# Altium schematic sheet sensor_node1.SchDoc
size Letter
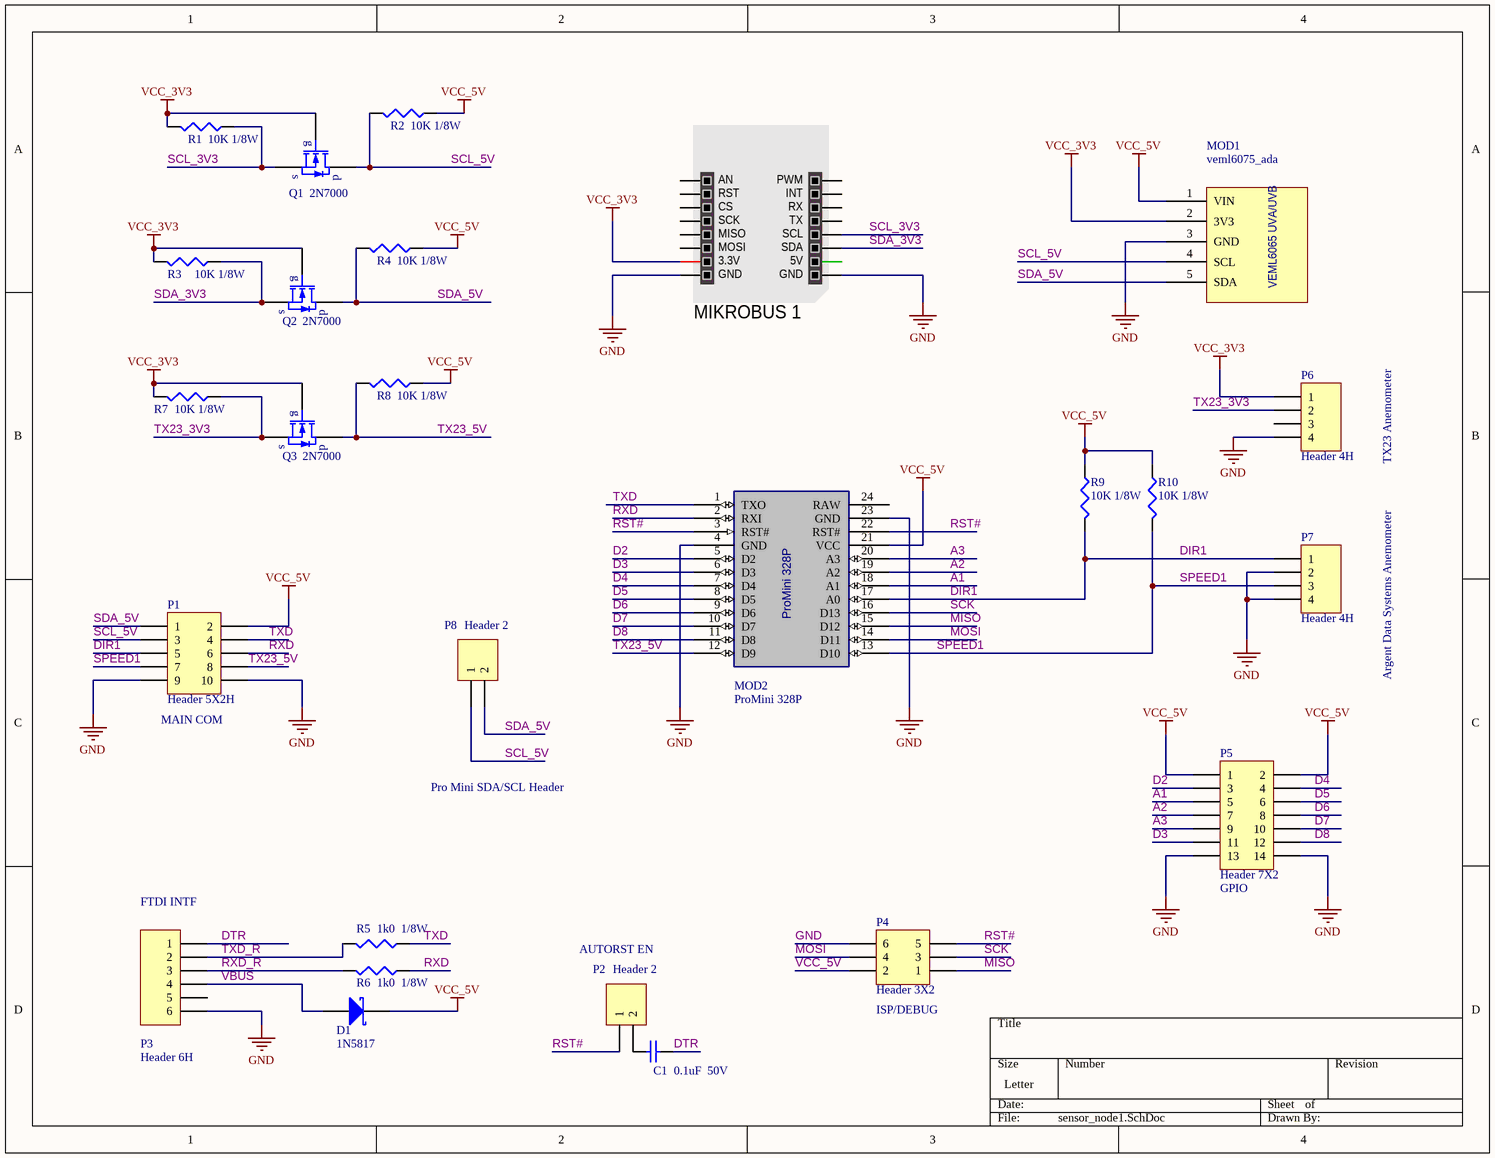
[diagram p0: sensor_node1.SchDoc]

## Parts
C1  value 0.1uF  50V  [CAPR2.54-4x3.2]  (hidden comment: Cap)
D1  1N5817  [DIODE-0.4]
MIKROBUS_1  MIKROBUS HOST CONN.  [MIKROBUS HOST CONN.]  (value not drawn)
MOD1  veml6075_ada  [HDR1X5]
MOD2  ProMini 328P  [promini]
P1  Header 5X2H  [HDR2X5H]
P2  Header 2  [HDR1X2]
P3  Header 6H  [HDR1X6H]
P4  Header 3X2  [HDR2X3]
P5  Header 7X2  [HDR2X7]
P6  Header 4H  [HDR1X4H]
P7  Header 4H  [HDR1X4H]
P8  Header 2  [HDR1X2]
Q1  2N7000  [2N7000-TO92]
Q2  2N7000  [2N7000-TO92]
Q3  2N7000  [2N7000-TO92]
R1  value 10K 1/8W  [RES6.5-3.4X1.9]  (hidden comment: Res3)
R2  value 10K 1/8W  [RES6.5-3.4X1.9]  (hidden comment: Res3)
R3  value 10K 1/8W  [RES6.5-3.4X1.9]  (hidden comment: Res3)
R4  value 10K 1/8W  [RES6.5-3.4X1.9]  (hidden comment: Res3)
R5  value 1k0  1/8W  [RES6.5-3.4X1.9]  (hidden comment: Res3)
R6  value 1k0  1/8W  [RES6.5-3.4X1.9]  (hidden comment: Res3)
R7  value 10K 1/8W  [RES6.5-3.4X1.9]  (hidden comment: Res3)
R8  value 10K 1/8W  [RES6.5-3.4X1.9]  (hidden comment: Res3)
R9  value 10K 1/8W  [RES6.5-3.4X1.9]  (hidden comment: Res3)
R10  value 10K 1/8W  [RES6.5-3.4X1.9]  (hidden comment: Res3)

## Nets
GND: MIKROBUS_1.8(GND) MIKROBUS_1.9(GND) MOD1.3(GND) MOD2.4(GND) MOD2.23(GND) P1.9 P1.10 P3.6 P4.6 P5.13 P5.14 P6.4 P7.2 P7.4
VCC_3V3: MIKROBUS_1.7(3.3V) MOD1.2(3V3) P6.1 Q1.2(G) Q2.2(G) Q3.2(G) R1.2 R3.2 R7.2
VCC_5V: D1.2(K) MOD1.1(VIN) MOD2.21(VCC) P1.2 P4.2 P5.1 P5.2 R2.1 R4.1 R8.1 R9.1 R10.1
A1: MOD2.18(A1) P5.5
A2: MOD2.19(A2) P5.7
A3: MOD2.20(A3) P5.9
D2: MOD2.5(D2) P5.3
D3: MOD2.6(D3) P5.11
D4: MOD2.7(D4) P5.4
D5: MOD2.8(D5) P5.6
D6: MOD2.9(D6) P5.8
D7: MOD2.10(D7) P5.10
D8: MOD2.11(D8) P5.12
DIR1: MOD2.17(A0) P1.5 P7.1 R9.2
DTR: C1.1 P3.1
MISO: MOD2.15(D12) P4.1
MOSI: MOD2.14(D11) P4.4
RST#: MOD2.3(RST#) MOD2.22(RST#) P2.1 P4.5
RXD: MOD2.2(RXI) P1.6 R6.1
RXD_R: P3.3 R6.2
SCK: MOD2.16(D13) P4.3
SCL_3V3: MIKROBUS_1.12(SCL) Q1.1(S) R1.1
SCL_5V: MOD1.4(SCL) P1.3 P8.1 Q1.3(D) R2.2
SDA_3V3: MIKROBUS_1.11(SDA) Q2.1(S) R3.1
SDA_5V: MOD1.5(SDA) P1.1 P8.2 Q2.3(D) R4.2
SPEED1: MOD2.13(D10) P1.7 P7.3 R10.2
TX23_3V3: P6.2 Q3.1(S) R7.1
TX23_5V: MOD2.12(D9) P1.8 Q3.3(D) R8.2
TXD: MOD2.1(TXO) P1.4 R5.1
TXD_R: P3.2 R5.2
VBUS: D1.1(A) P3.4
NetC1_2: C1.2 P2.2

Not connected (* = marked no-connect by the designer): MIKROBUS_1 1(AN) 2(RST) 3(CS) 4(SCK) 5(MISO) 6(MOSI) 10(5V) 13(TX) 14(RX) 15(INT) 16(PWM); MOD2 24(RAW); P3 5; P6 3

## Notes on the sheet
- TX23 Anemometer
- Argent Data Systems Anemometer
- (near P1) MAIN COM
- Pro Mini SDA/SCL Header
- (near P3) FTDI INTF
- (near P5) GPIO
- AUTORST EN
- (near P4) ISP/DEBUG
- (in symbol 2N7000) g; s; d
- (in symbol veml6075_ada) VEML6065 UVA/UVB

## Library data of the parts
C1 = Cap: Manufacturer: Vishay BC Components; PartNumber: K104K15X7RF5TL2; Digi-Key Part#: BC1084CT-ND
D1 = D Schottky: Manufacturer: Micro Commercial Co; PartNumber: 1N5817-TP; Digi-Key Part#: 1N5817-TPCT-ND; Value: 1N5817
MIKROBUS_1 = MIKROBUS HOST CONN._1: mikroBUS Host Socket; PartNumber: PPTC081LFBN-RC; Value: 8POS 0.1 TIN; Digi-Key Part#: S7006-ND
MOD2 = promini_328P: Manufacturer: Sullins; PartNumber: PPTC051LFBN-RC; Value: 12POS 0.1 TIN; Digi-Key Part#: S6100-ND
P1 = Header 5X2H: Header, 5-Pin, Dual row, Right Angle
P5 = Header 7X2: Header, 7-Pin, Dual row
P6 P7 = Header 4H: Header, 4-Pin, Right Angle
Q1-Q3 = 2N7000: 2N7000 - TO92; Manufacturer: Microchip Technology; PartNumber: 2N7000-G; Value: MOSFET N-CH 60V 0.2A TO92-3; Digi-Key Part#: 2N7000-G-ND
R1-R4 R7-R10 = Res3: Resistor; Manufacturer: Stackpole; PartNumber: CF18JT10K0; Digi-Key Part#: CF18JT10K0CT-ND
R5 R6 = Res3: Manufacturer: Stackpole; PartNumber: CF18JT1K00; Digi-Key Part#: CF18JT1K00CT-ND